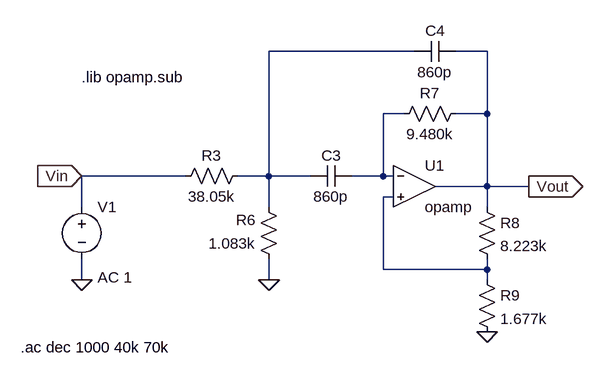
[diagram p0: schematic cell2_sim.asc]
cell2_sim.asc, the LTspice schematic file:
Version 4
SHEET 1 1440 680
WIRE 1088 -16 864 -16
WIRE 1200 -16 1152 -16
WIRE 1072 80 1040 80
WIRE 1200 80 1200 -16
WIRE 1200 80 1152 80
WIRE 736 176 576 176
WIRE 864 176 864 -16
WIRE 864 176 816 176
WIRE 928 176 864 176
WIRE 1040 176 1040 80
WIRE 1040 176 992 176
WIRE 1056 176 1040 176
WIRE 1200 192 1200 80
WIRE 1200 192 1120 192
WIRE 1264 192 1200 192
WIRE 1056 208 1040 208
WIRE 576 224 576 176
WIRE 864 224 864 176
WIRE 1200 224 1200 192
WIRE 1040 320 1040 208
WIRE 1200 320 1200 304
WIRE 1200 320 1040 320
WIRE 576 336 576 304
WIRE 864 336 864 304
WIRE 1200 336 1200 320
FLAG 576 336 0
FLAG 576 176 Vin
IOPIN 576 176 In
FLAG 864 336 0
FLAG 1264 192 Vout
IOPIN 1264 192 Out
FLAG 1200 416 0
SYMBOL voltage 576 208 R0
WINDOW 123 24 124 Left 2
WINDOW 39 0 0 Left 0
SYMATTR Value2 AC 1
SYMATTR InstName V1
SYMATTR Value ""
SYMBOL res 832 160 R90
WINDOW 0 0 56 VBottom 2
WINDOW 3 32 56 VTop 2
SYMATTR InstName R3
SYMATTR Value 38.05k
SYMBOL res 880 320 R180
WINDOW 0 36 76 Left 2
WINDOW 3 36 40 Left 2
SYMATTR InstName R6
SYMATTR Value 1.083k
SYMBOL res 1168 64 R90
WINDOW 0 0 56 VBottom 2
WINDOW 3 32 56 VTop 2
SYMATTR InstName R7
SYMATTR Value 9.480k
SYMBOL res 1184 208 R0
SYMATTR InstName R8
SYMATTR Value 8.223k
SYMBOL res 1184 320 R0
SYMATTR InstName R9
SYMATTR Value 1.677k
SYMBOL cap 992 160 R90
WINDOW 0 0 32 VBottom 2
WINDOW 3 32 32 VTop 2
SYMATTR InstName C3
SYMATTR Value 860p
SYMBOL cap 1152 -32 R90
WINDOW 0 0 32 VBottom 2
WINDOW 3 32 32 VTop 2
SYMATTR InstName C4
SYMATTR Value 860p
SYMBOL Opamps\\opamp 1088 128 R0
SYMATTR InstName U1
TEXT 576 24 Left 2 !.lib opamp.sub
TEXT 482 440 Left 2 !.ac dec 1000 40k 70k

The netlist it stands for:
* cell2_sim.asc
V1 Vin 0 AC 1
R3 N001 Vin 38.05k
R6 0 N001 1.083k
R7 Vout N002 9.480k
R8 Vout N003 8.223k
R9 N003 0 1.677k
C3 N002 N001 860p
C4 Vout N001 860p
XU1 N002 N003 Vout opamp Aol=100K GBW=10Meg  ; pins invin noninvin out
.lib opamp.sub
.ac dec 1000 40k 70k
.backanno
.end

* Results of the author's LTspice run, read from the files saved beside the schematic
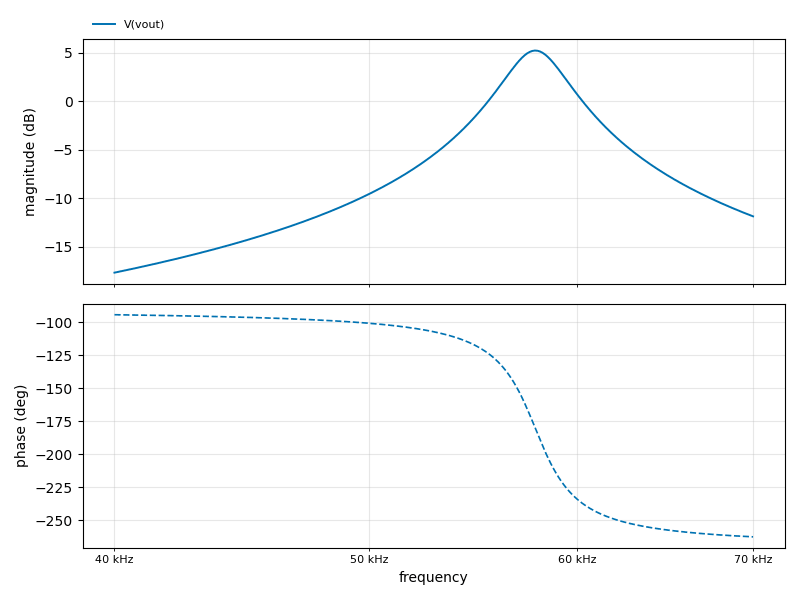
[diagram p1: AC Analysis of cell2_sim.asc, plotted from the saved traces]
* AC Analysis, 1 run:
*   V(vout): -17.69 dB at 40 kHz, -11.88 dB at 70 kHz, peak 5.21 dB at 57.82 kHz, 3 dB below the peak at 56.29 kHz and 59.43 kHz